# EAGLE schematic thingy (EAGLE 7.7.0)
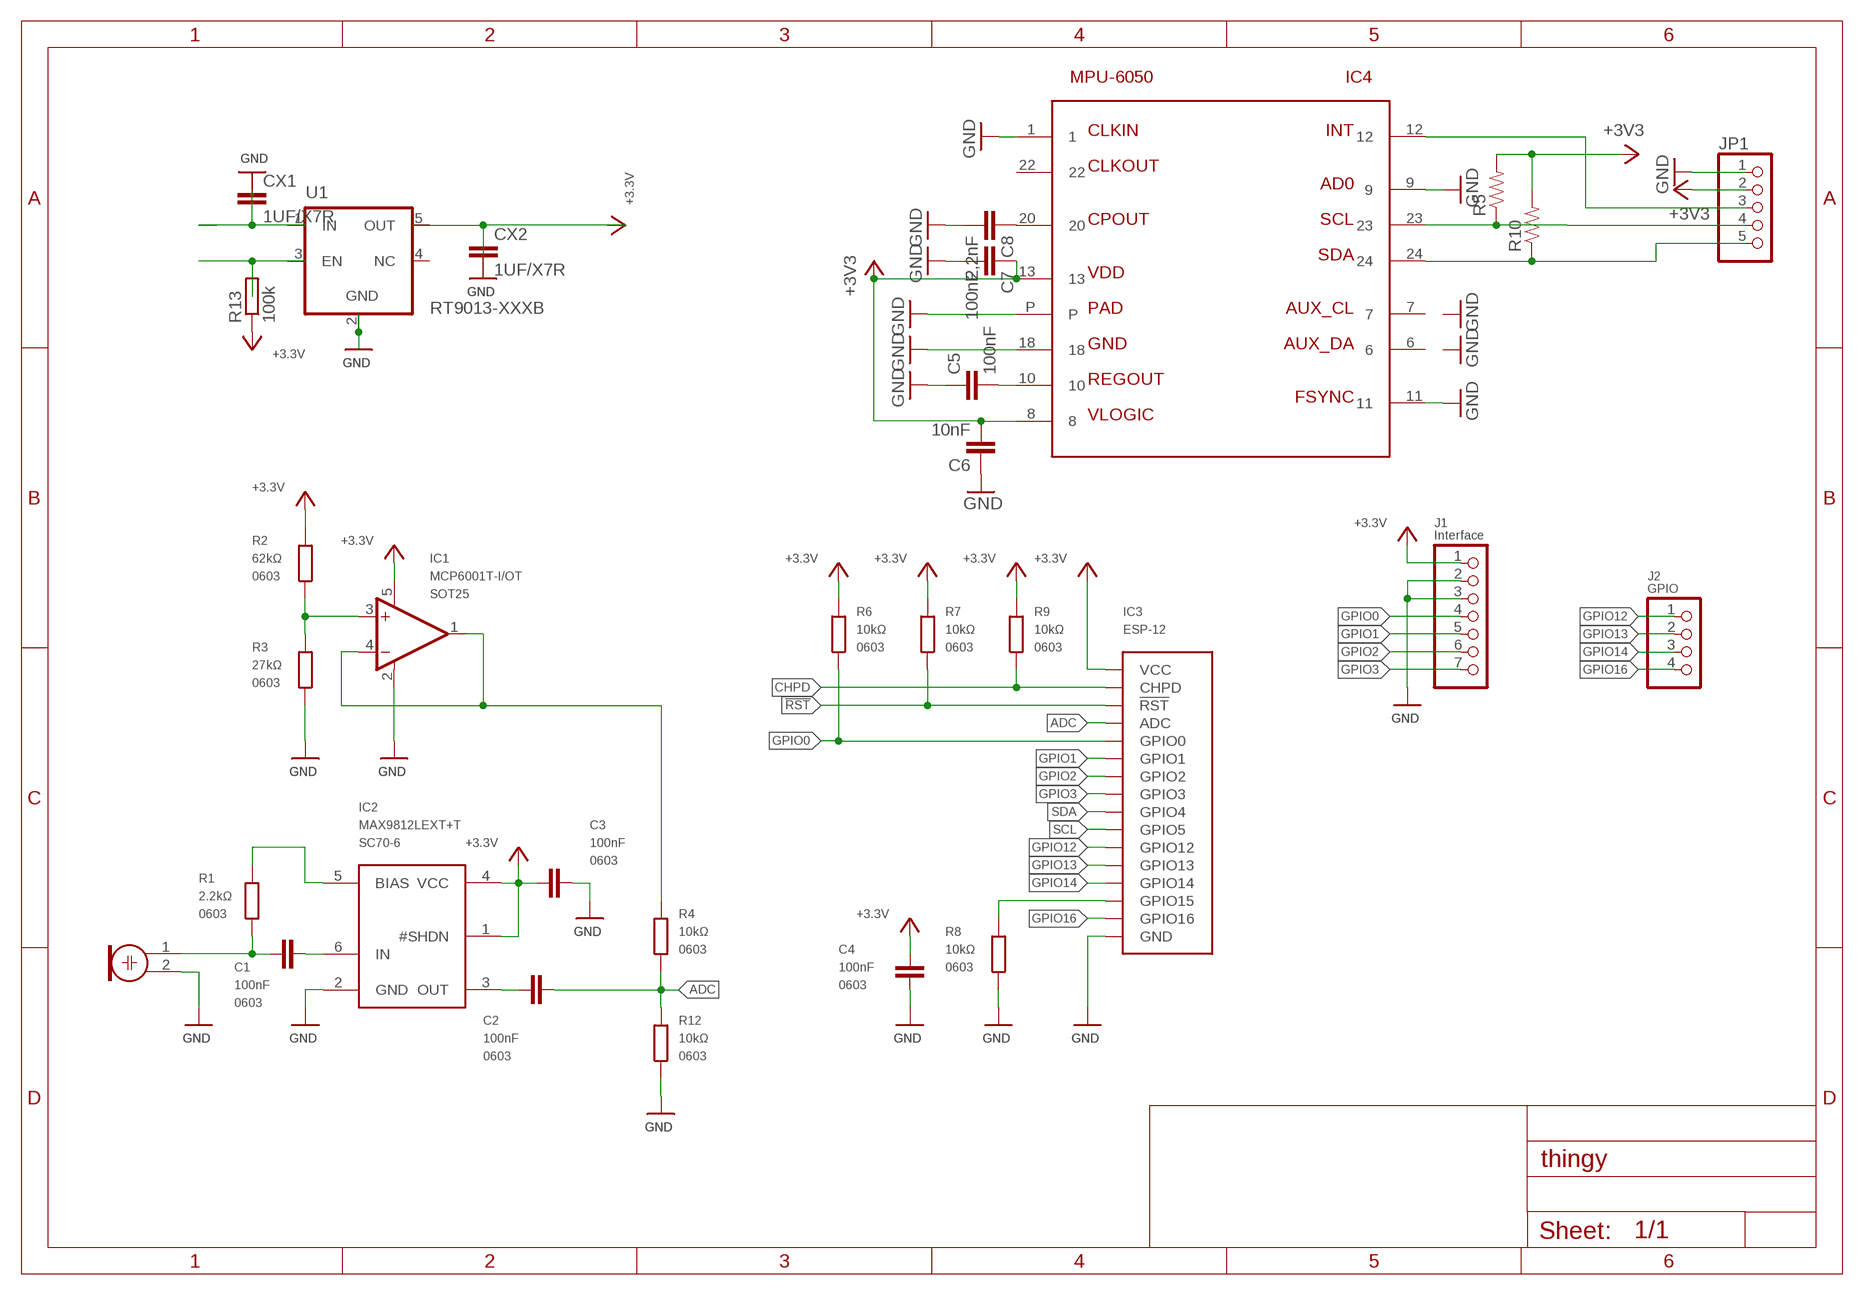
[diagram p0: schematic, sheet 1]

## Parts
C1  100nF  C0603  [0603]
C2  100nF  C0603  [0603]
C3  100nF  C0603  [0603]
C4  100nF  C0603  [0603]
C5  100nF  CAP0402-CAP  [0402-CAP]
C6  10nF  CAP0402-CAP  [0402-CAP]
C7  100nF  CAP0402-CAP  [0402-CAP]
C8  2,2nF  CAP0402-CAP  [0402-CAP]
CX1  1UF/X7R  CXXC10B5  [XC10B5]
CX2  1UF/X7R  CXXC10B5  [XC10B5]
IC1  MCP6001T-I/OT  OPA340N  [SOT23-5]
IC2  MAX9812LEXT+T  MAX9812  [SC-70-6]
IC3  ESP-12  [ESP-12]
IC4  MPU-6050  [QFN24]
J1  Interface  PINHD-1X7  [1X07]
J2  GPIO  PINHD-1X4  [1X04]
JP1  PINHD-1X05_2.54  [1X05]
Q1  Electret Mic  ELECTRET_MICROPHON-WM.64PN  [WM-64PN]
R1  2.2kΩ  R0603  [0603]
R2  62kΩ  R0603  [0603]
R3  27kΩ  R0603  [0603]
R4  10kΩ  R0603  [0603]
R5  RESISTOR0402-RES  [0402-RES]
R6  10kΩ  R0603  [0603]
R7  10kΩ  R0603  [0603]
R8  10kΩ  R0603  [0603]
R9  10kΩ  R0603  [0603]
R10  RESISTOR0402-RES  [0402-RES]
R12  10kΩ  R0603  [0603]
R13  100k  R-EU_R0603  [R0603]
U1  RT9013-XXXB  [SOT23-5]

## Nets
1UF/X7R: CX1.2
!RST: IC3.RST(!RST) R7.1
+3.3V: C3.1 C4.1 IC1.5(V+) IC2.1(#SHDN) IC2.4(VCC) IC3.VCC J1.1 R2.2 R6.2 R7.2 R9.2
+3V3: C6.2 C7.1 IC4.8 IC4.13 JP1.2 R5.2 R10.2
ADC: C2.2 IC3.ADC R4.1 R12.2
CHPD: IC3.CHPD R9.1
GND: C3.2 C4.2 C5.1 C6.1 C7.2 C8.2 IC1.2(V-) IC2.2(GND) IC3.GND IC4.1 IC4.9 IC4.11 IC4.18 IC4.P J1.2 J1.3 JP1.1 Q1.2 R3.1 R8.1 R12.1
GPIO0: IC3.GPIO0 J1.4 R6.1
GPIO1: IC3.GPIO1 J1.5
GPIO2: IC3.GPIO2 J1.6
GPIO3: IC3.GPIO3 J1.7
GPIO12: IC3.GPIO12 J2.1
GPIO13: IC3.GPIO13 J2.2
GPIO14: IC3.GPIO14 J2.3
GPIO16: IC3.GPIO16 J2.4
INT: IC4.12 JP1.3
N$1: IC1.1(OUT) IC1.4(-IN) R4.2
N$2: C5.2 IC4.10
N$3: C8.1 IC4.20
N$4: CX2.1 CX2.2
N$6: R13.2
N$7: IC3.GPIO15 R8.2
N$11: IC1.3(+IN) R2.1 R3.2
N$13: C2.1 IC2.3(OUT)
N$14: C1.1 Q1.1 R1.1
N$15: C1.2 IC2.6(IN)
N$16: IC2.5(BIAS) R1.2
SCL: IC3.GPIO5
SCL1: IC4.23 JP1.4 R5.1
SDA: IC3.GPIO4
SDA1: IC4.24 JP1.5 R10.1
Unconnected: CX1.1 IC4.6 IC4.7 IC4.22 R13.1 U1.1(IN) U1.3(EN) U1.4(NC) U1.5(OUT)

## Power pins joined to a net without a drawn wire
GND: U1.2(GND)

## Library data of the parts
C1-C4 = freetronics-luke:C; PACKAGE: 0603
C5-C8 = SparkFun:CAP: Capacitor Standard 0603 ceramic capacitor, and 0.1" leaded capacitor.
CX1 CX2 = rcl:CX: X CAPACITOR for power line
IC1 = burr-brown:OPA340: Rail-to-Rail Operational Amplifiers Single-Supply, MicroAmplifier(TM) Series; MPN: OPA340NA/3KG4; OC_FARNELL: 1234805; OC_NEWARK: 13M5177; PACKAGE: SOT25
IC2 = MAX9812:MAX9812: Maxim's MAX9812 Tiny, Low-Cost, Single/Dual-Input, Fixed-Gain Microphone Amplifiers with Integrated Bias Description: The MAX9812/MAX9813 are single/dual-input, 20dB fixed-gain microphone amplifiers. They offer tiny packaging and a low-noise, integrated microphone bias, making them ideal for portable audio applications such as notebook computers, cell phones, and PDAs. These amplifiers feature a 500kHz bandwidth, Rail-to-Rail® outputs, an industry-leading 100dB power-supply rejection ratio, and a very low 0.015% THD+N. Power-saving features include very low 230?A supply current and a total shutdown mode that cuts the combined supply and BIAS currents to only 100nA. The MAX9812 is a single amplifier in a 6-pin SC70 package (2mm x 2.1mm) and the MAX9813 is a dualinput amplifier available in an 8-pin SOT23 (3mm x 3mm) package. The MAX9813 has two inputs allowing two microphones to be multiplexed to a single output. The MAX9812/MAX9813 are offered in two grades. The MAX9812L/MAX9813L are optimized for 3.3V supply operation (2.7V to 3.6V). The MAX9812H/MAX9813H are PC2001 compliant and are optimized for 5V operation (4.5V to 5.5V). Both devices are specified over the -40°C to +85°C extended operating temperature range. Features: PC2001 Compliant 100dB at 217Hz Power-Supply Rejection Ratio Very Low 230?A Quiescent Current Low 0.015% THD+N Available in Two Versions: - MAX9812L/MAX9813L?2.7V to 3.6V - MAX9812H/MAX9813H?4.5V to 5.5V Internal Low-Noise Microphone Bias Supply - 2.3V for MAX9812L/MAX9813L - 4.0V for MAX9812H/MAX9813H 100nA Low-Power Shutdown Mode Rail-to-Rail Outputs 20dB Fixed Gain Available in Tiny 6-Pin SC70 (2mm x 2.1mm) and 8-Pin SOT23 (3mm x 3mm) Packages Extended Temperature Range -40°C to +85°C Applications: Notebook Computers PDAs Smart Phones Car Kit Adapters Digital Cameras Video Tape Recorders Please send any comments to: messi@users.sourceforge.net; PACKAGE: SC70-6
IC3 = freetronics-luke:ESP-12
IC4 = seb:MPU-6050
J1 = pinhead:PINHD-1X7: PIN HEADER
J2 = pinhead:PINHD-1X4: PIN HEADER
JP1 = pinhead-2:PINHD-1X05: PIN HEADER
Q1 = microphon:ELECTRET_MICROPHON-: Electret Condenser Microphone
R1-R4 R6-R9 R12 = freetronics-luke:R; PACKAGE: 0603
R5 R10 = SparkFun:RESISTOR: Resistor Basic schematic elements and footprints for 0603, 1206, and PTH 1/10th watt (small) resistors.
R13 = resistor:R-EU_: RESISTOR, European symbol
U1 = v-reg-new:RT9013-XXX: LDO REGULATOR 500mA, Low Dropout, Low Noise Ultra-Fast without bypass capacitor CMOS LDO Regulator